# EAGLE schematic Kom_modul_uptodate (EAGLE 6.5.0)
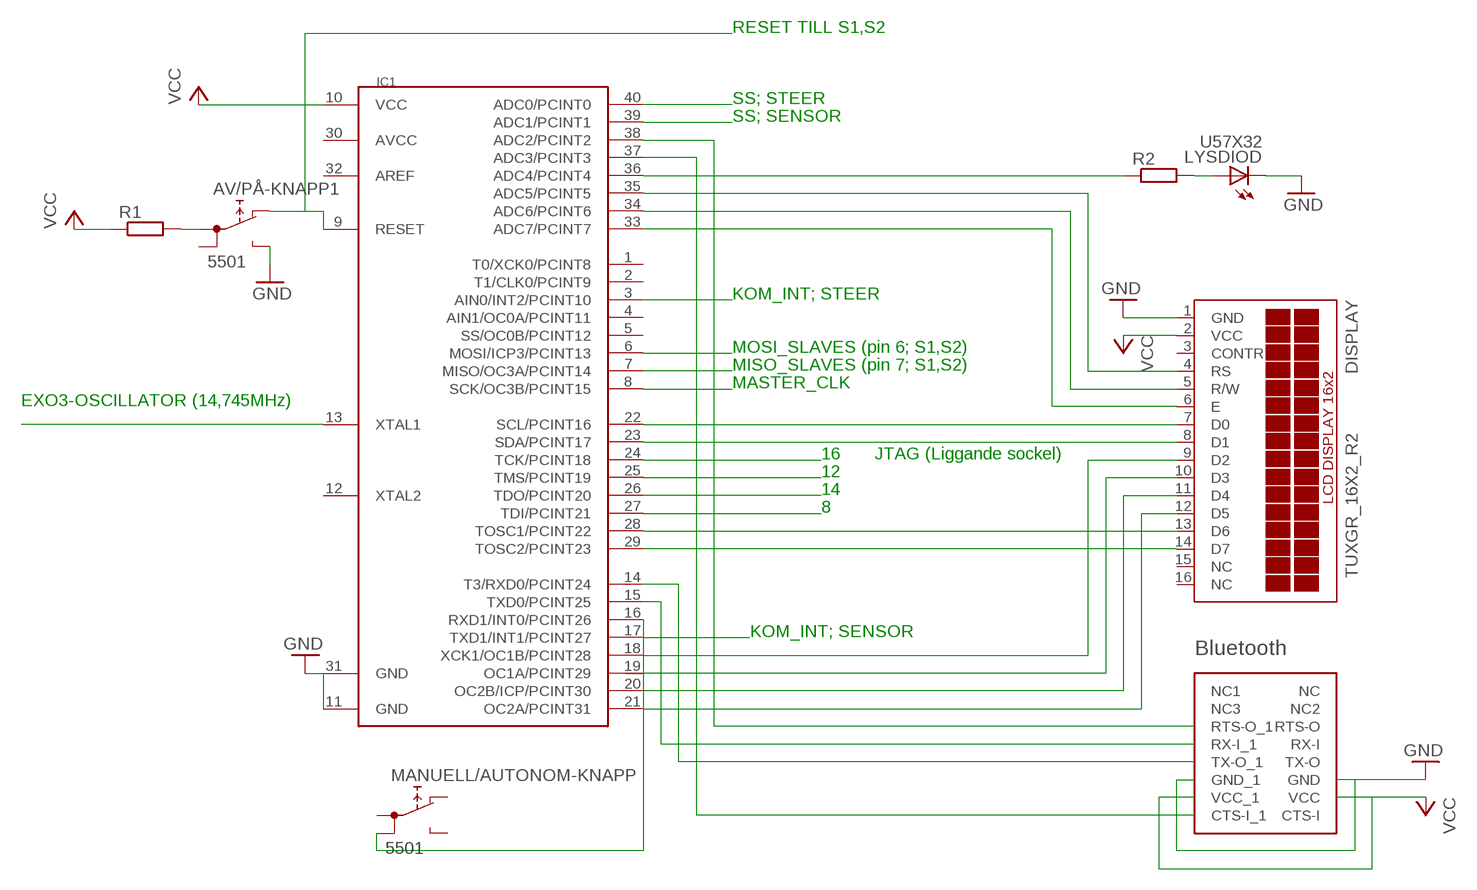
[diagram p0: schematic, sheet 1]

## Parts
AV/PÅ-KNAPP1  5501  [5501]
DISPLAY  TUXGR_16X2_R2  [TUXGR_16X2_R2]
IC1  MEGA1284P  [DIL40]
LYSDIOD  U57X32  [U57X32]
MANUELL/AUTONOM-KNAPP  5501  [5501]
R1  R-EU_0309/V  [0309V]
R2  R-EU_0309/V  [0309V]
U$1  BLUETOOTH  [BLUETOOTH]

## Nets
GND: AV/PÅ-KNAPP1.NO DISPLAY.1(GND) IC1.11(GND) IC1.31(GND) LYSDIOD.K(C) U$1.GND U$1.GND_1
N$1: IC1.7(MISO/OC3A/PCINT14)
N$2: IC1.6(MOSI/ICP3/PCINT13)
N$3: IC1.8(SCK/OC3B/PCINT15)
N$5: IC1.39(ADC1/PCINT1) U$1.RTS-O(RTS-O_1)
N$6: IC1.10(VCC)
N$7: DISPLAY.7(D0) DISPLAY.8(D1) DISPLAY.9(D2) DISPLAY.10(D3) DISPLAY.11(D4) DISPLAY.12(D5) IC1.18(XCK1/OC1B/PCINT28) IC1.20(OC2B/ICP/PCINT30) IC1.21(OC2A/PCINT31) IC1.22(SCL/PCINT16)
N$8: AV/PÅ-KNAPP1.NC IC1.9(RESET)
N$9: DISPLAY.4(RS) IC1.35(ADC5/PCINT5)
N$10: DISPLAY.5(R/W) IC1.34(ADC6/PCINT6)
N$11: DISPLAY.6(E) IC1.33(ADC7/PCINT7)
N$12: IC1.24(TCK/PCINT18)
N$13: IC1.13(XTAL1)
N$14: AV/PÅ-KNAPP1.1A R1.2
N$15: IC1.3(AIN0/INT2/PCINT10)
N$16: IC1.17(TXD1/INT1/PCINT27)
N$17: IC1.19(OC1A/PCINT29)
N$18: IC1.16(RXD1/INT0/PCINT26) MANUELL/AUTONOM-KNAPP.1B
N$19: LYSDIOD.A R2.2
N$20: IC1.36(ADC4/PCINT4) R2.1
N$21: DISPLAY.13(D6) IC1.28(TOSC1/PCINT22)
N$22: DISPLAY.14(D7) IC1.29(TOSC2/PCINT23)
N$23: IC1.26(TDO/PCINT20)
N$24: IC1.25(TMS/PCINT19)
N$25: IC1.27(TDI/PCINT21)
N$26: IC1.15(TXD0/PCINT25) U$1.RX-O_1(RX-I_1)
N$27: IC1.14(T3/RXD0/PCINT24) U$1.TX-O_1
N$28: IC1.37(ADC3/PCINT3) U$1.CTS-I_1
VCC: DISPLAY.2(VCC) R1.1 U$1.VCC U$1.VCC_1
Unconnected: AV/PÅ-KNAPP1.1B DISPLAY.3(CONTR) DISPLAY.15(NC) DISPLAY.16(NC) IC1.1(T0/XCK0/PCINT8) IC1.2(T1/CLK0/PCINT9) IC1.4(AIN1/OC0A/PCINT11) IC1.5(SS/OC0B/PCINT12) IC1.12(XTAL2) IC1.23(SDA/PCINT17) IC1.30(AVCC) IC1.32(AREF) IC1.38(ADC2/PCINT2) IC1.40(ADC0/PCINT0) MANUELL/AUTONOM-KNAPP.1A MANUELL/AUTONOM-KNAPP.NC MANUELL/AUTONOM-KNAPP.NO U$1.CTS-I U$1.NC U$1.NC1 U$1.NC2 U$1.NC3 U$1.RTS-0_1(RTS-O) U$1.RX-I U$1.TX-O

## Notes on the sheet
- RESET TILL S1,S2
- SS; STEER
- SS; SENSOR
- KOM_INT; STEER
- MOSI_SLAVES (pin 6; S1,S2)
- MISO_SLAVES (pin 7; S1,S2)
- MASTER_CLK
- EXO3-OSCILLATOR (14,745MHz)
- 16 | JTAG (Liggande sockel)
- 12
- 14
- 8
- KOM_INT; SENSOR

## Library data of the parts
AV/PÅ-KNAPP1 MANUELL/AUTONOM-KNAPP = switch:55?: PUSHBUTTON SERIES 5500 SWITCHES Source: www.e-switch.com .. 5500.pdf
DISPLAY = display-lcd:TUXGR_16X2_R2: Tuxgraphics LCD display 16x2 characters reflective, without background light Source: tuxgr_12x2_r2.pdf; OC_FARNELL: unknown; OC_NEWARK: unknown
IC1 = 1284p:MEGA1284P: Atmel ATmega1284P 8-bit AVR Microcontroller
LYSDIOD = led:U57X32: LED rectangle, 5.7 x 3.2 mm
R1 R2 = resistor:R-EU_: RESISTOR, European symbol
U$1 = BLUETOOTH:BLUETOOTH